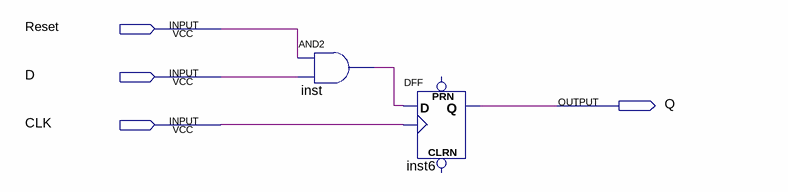
[diagram p0: schematic sheet]
// Quartus schematic DFF2.bdf as structural Verilog: 2 symbols, 4 pins
module DFF2 (
  input  Reset,
  input  D,
  input  CLK,
  output Q
);

  wire inst_out;

  and inst (inst_out, Reset, D);
  DFF inst6 (.CLK(CLK), .D(inst_out), .Q(Q));  // open: CLRN, PRN
endmodule
